# EAGLE design main (EAGLE 7.1.0)
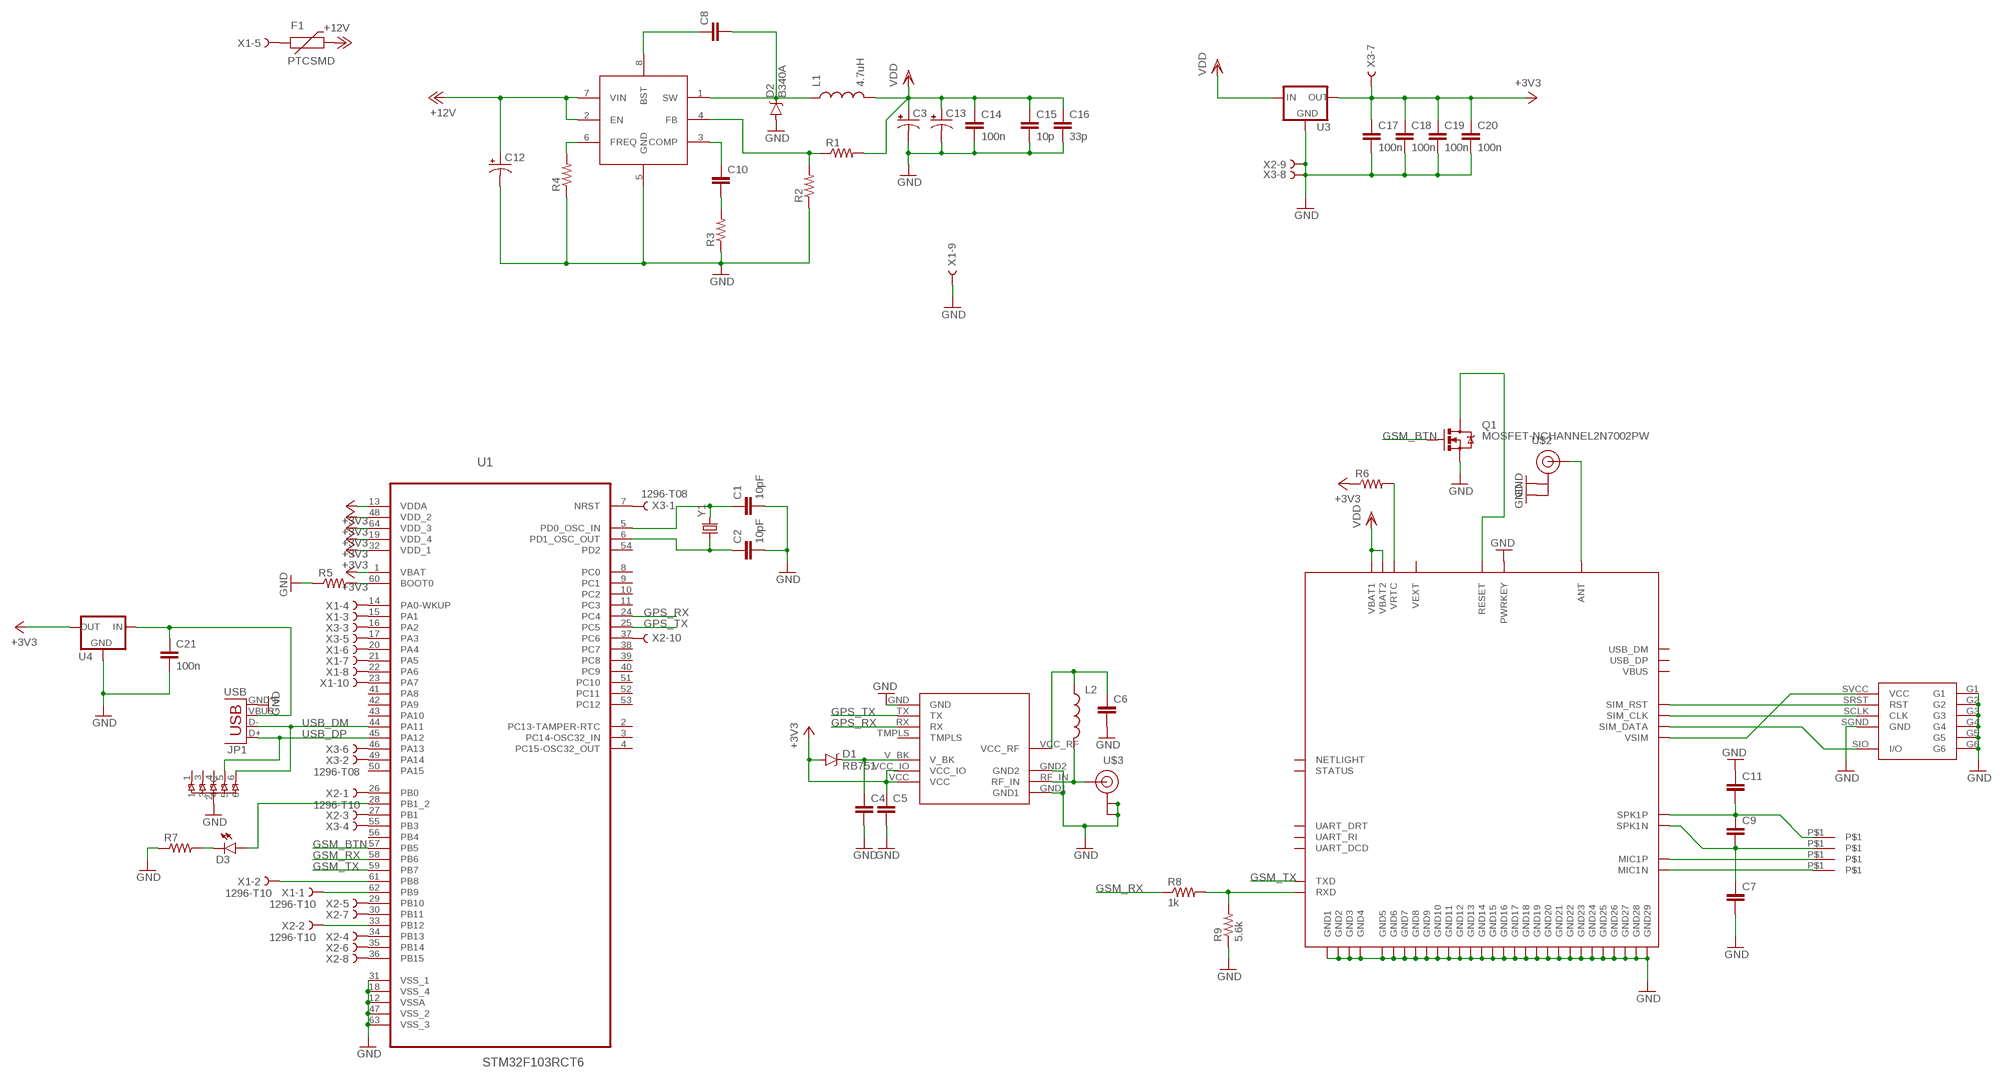
[diagram p0: schematic, sheet 1]

## Parts
C1  10pF  10PF-50V-5%(0603)  [0603-CAP]
C2  10pF  10PF-50V-5%(0603)  [0603-CAP]
C3  CAP_POL6032  [EIA6032]
C4  CAP1210  [1210]
C5  CAP1210  [1210]
C6  CAP0402-CAP  [0402-CAP]
C7  CAP0402-CAP  [0402-CAP]
C8  CAP0805  [0805]
C9  CAP0402-CAP  [0402-CAP]
C10  CAP0402-CAP  [0402-CAP]
C11  CAP0402-CAP  [0402-CAP]
C12  CPOL-USSMCC  [SMC_C]
C13  CAP_POL6032  [EIA6032]
C14  100n  CAP0805  [0805]
C15  10p  CAP0402-CAP  [0402-CAP]
C16  33p  CAP0402-CAP  [0402-CAP]
C17  100n  CAP0805  [0805]
C18  100n  CAP0805  [0805]
C19  100n  CAP0805  [0805]
C20  100n  CAP0805  [0805]
C21  100n  CAP0805  [0805]
D1  RB751  DIODE-SCHOTTKY-RB751  [SOD-523]
D2  B340A  DIODE-SCHOTTKY-B340A  [SMA-DIODE]
D3  LED0603  [LED-0603]
F1  PTCSMD  [PTC-1206]
JP1  USB  [USB-MICROB-2]
L1  4.7uH  INDUCTOR68UH-1A  [CR75]
L2  INDUCTOR0402  [C0402]
Q1  MOSFET-NCHANNEL2N7002PW  [SOT323]
R1  RESISTOR0402-RES  [0402-RES]
R2  RESISTOR0402-RES  [0402-RES]
R3  RESISTOR0402-RES  [0402-RES]
R4  RESISTOR0402-RES  [0402-RES]
R5  RESISTOR0402-RES  [0402-RES]
R6  RESISTOR0402-RES  [0402-RES]
R7  RESISTOR0402-RES  [0402-RES]
R8  1k  RESISTOR0402-RES  [0402-RES]
R9  5.6k  RESISTOR0402-RES  [0402-RES]
U1  STM32F103RCT6  [QFP50P1200X1200X160-64N]
U2  MP1584  [SO8]
U3  XC63FPM  [SOT23]
U4  XC63FPM  [SOT23]
U5  SMF05C  [SC70-6L]
U$1  SIM800_MIN  [SIM800_MIN]
U$2  U.FL  [U.FL2]
U$3  U.FL  [U.FL2]
U$4  VK_GPS_U7_MIN  [VK_GPS_U7_MIN]
U$7  SIM_NOVPP  [WURTH_NANO_SIM_NOVPP]
U$8  PAD1  [PAD1]
U$9  PAD1  [PAD1]
U$13  PAD1  [PAD1]
U$14  PAD1  [PAD1]
X1  1296-T10  [1296-10]
X2  1296-T10  [1296-10]
X3  1296-T08  [1296-08]
Y1  CRYSTAL5X3  [CRYSTAL-SMD-5X3]

## Nets
+3V3: C5.1 C17.1 C18.1 C19.1 C20.1 D1.A R6.1 U1.1(VBAT) U1.13(VDDA) U1.19(VDD_4) U1.32(VDD_1) U1.48(VDD_2) U1.64(VDD_3) U3.2(OUT) U4.2(OUT) U$4.VCC U$4.VCC_IO X3.7
+12V: C12.+ F1.2 U2.2(EN) U2.7(VIN)
GND: C1.2 C2.2 C3.P$2(-) C4.2 C5.2 C6.2 C7.2 C11.1 C12.- C13.P$2(-) C14.2 C15.2 C16.2 C17.2 C18.2 C19.2 C20.2 C21.2 D2.A JP1.GND JP1.MT1(GND) JP1.MT2(GND) JP1.P$1(GND) JP1.P$2(GND) Q1.2(S) R2.1 R3.1 R4.1 R5.1 R7.1 R9.1 U1.12(VSSA) U1.18(VSS_4) U1.31(VSS_1) U1.47(VSS_2) U1.63(VSS_3) U2.5(GND) U3.1(GND) U4.1(GND) U5.2(C) U$1.P$2(GND1) U$1.P$6(GND2) U$1.P$8(GND3) U$1.P$35(GND29) U$1.P$37(GND28) U$1.P$38(GND27) U$1.P$39(GND26) U$1.P$41(GND25) U$1.P$43(GND22) U$1.P$44(GND23) U$1.P$45(GND24) U$1.P$48(PWRKEY) U$1.P$58(GND4) U$1.P$67(GND17) U$1.P$71(GND18) U$1.P$72(GND19) U$1.P$73(GND20) U$1.P$76(GND21) U$1.P$77(GND5) U$1.P$78(GND6) U$1.P$79(GND7) U$1.P$80(GND8) U$1.P$81(GND9) U$1.P$82(GND10) U$1.P$83(GND11) U$1.P$84(GND12) U$1.P$85(GND13) U$1.P$86(GND14) U$1.P$87(GND15) U$1.P$88(GND16) U$2.P$1(GND) U$2.P$2(GND) U$3.P$1(GND) U$3.P$2(GND) U$4.GND U$4.GND1 U$4.GND2 U$7.G1 U$7.G2 U$7.G3 U$7.G4 U$7.G5 U$7.G6 U$7.SGND(GND) X1.9 X2.9 X3.8
GPS_RX: U1.24(PC4) U$4.RX
GPS_TX: U1.25(PC5) U$4.TX
GSM_BTN: Q1.1(G) U1.57(PB5)
GSM_RX: R8.1 U1.58(PB6)
GSM_TX: U1.59(PB7) U$1.P$32(TXD)
N$1: U$1.P$40(ANT) U$2.P$3(SIGNAL)
N$2: C1.1 U1.5(PD0_OSC_IN) Y1.3
N$3: C2.1 U1.6(PD1_OSC_OUT) Y1.1
N$4: U1.16(PA2) X3.3
N$5: U1.17(PA3) X3.5
N$6: U1.7(NRST) X3.1
N$7: U1.55(PB3) X3.4
N$8: U1.49(PA14) X3.2
N$9: U1.46(PA13) X3.6
N$10: C7.1 C9.2 U$1.P$13(SPK1N) U$9.P$1
N$11: U$1.P$15(SIM_RST) U$7.SRST(RST)
N$12: U$1.P$55(SIM_CLK) U$7.SCLK(CLK)
N$13: U$1.P$14(SIM_DATA) U$7.SIO(I/O)
N$14: U$1.P$16(VSIM) U$7.SVCC(VCC)
N$15: C9.1 C11.2 U$1.P$53(SPK1P) U$8.P$1
N$16: U$1.P$52(MIC1P) U$13.P$1
N$17: U$1.P$12(MIC1N) U$14.P$1
N$18: L2.2 U$3.P$3(SIGNAL) U$4.RF_IN
N$19: Q1.3(D) U$1.P$49(RESET)
N$20: U1.61(PB8) X1.2
N$21: C4.1 D1.C U$4.V_BK
N$22: C6.1 L2.1 U$4.VCC_RF
N$23: U1.62(PB9) X1.1
N$24: C8.1 U2.8(BST)
N$25: C8.2 D2.C L1.P$1 U2.1(SW)
N$26: R5.2 U1.60(BOOT0)
N$27: C10.1 U2.3(COMP)
N$28: C10.2 R3.2
N$29: R1.1 R2.2 U2.4(FB)
N$30: U1.15(PA1) X1.3
N$31: U1.14(PA0-WKUP) X1.4
N$32: U1.27(PB1) X2.3
N$33: U1.20(PA4) X1.6
N$34: U1.21(PA5) X1.7
N$35: R4.2 U2.6(FREQ)
N$36: U1.22(PA6) X1.8
N$37: U1.23(PA7) X1.10
N$38: U1.26(PB0) X2.1
N$39: U1.29(PB10) X2.5
N$40: U1.30(PB11) X2.7
N$41: U1.33(PB12) X2.2
N$42: U1.34(PB13) X2.4
N$43: U1.35(PB14) X2.6
N$44: U1.36(PB15) X2.8
N$45: U1.37(PC6) X2.10
N$46: F1.1 X1.5
N$47: C21.1 JP1.VBUS U4.3(IN)
N$49: R6.2 U$1.P$56(VRTC)
N$51: D3.A U1.28(PB1_2)
N$52: D3.C R7.2
N$53: R8.2 R9.2 U$1.P$31(RXD)
USB_DM: JP1.D- U1.44(PA11) U5.6
USB_DP: JP1.D+ U1.45(PA12) U5.5
VDD: C3.P$1(+) C13.P$1(+) C14.1 C15.1 C16.1 L1.P$2 R1.2 U3.3(IN) U$1.P$1(VBAT1) U$1.P$42(VBAT2)
Unconnected: U1.2(PC13-TAMPER-RTC) U1.3(PC14-OSC32_IN) U1.4(PC15-OSC32_OUT) U1.8(PC0) U1.9(PC1) U1.10(PC2) U1.11(PC3) U1.38(PC7) U1.39(PC8) U1.40(PC9) U1.41(PA8) U1.42(PA9) U1.43(PA10) U1.50(PA15) U1.51(PC10) U1.52(PC11) U1.53(PC12) U1.54(PD2) U1.56(PB4) U5.1 U5.3 U5.4 U$1.P$4(STATUS) U$1.P$7(VBUS) U$1.P$18(VEXT) U$1.P$19(USB_DM) U$1.P$59(USB_DP) U$1.P$64(NETLIGHT) U$1.P$68(UART_RI) U$1.P$69(UART_DRT) U$1.P$70(UART_DCD) U$4.TMPLS

## Library data of the parts
C1 C2 = SparkFun-Capacitors:10PF-50V-5%(0603): CAP-11812; PROD_ID: CAP-11812
C3 C13 = SparkFun-Passives:CAP_POL: Capacitor Polarized These are standard SMD and PTH capacitors. Normally 10uF, 47uF, and 100uF in electrolytic and tantalum varieties. Always verify the external diameter of the through hole cap, it varies with capacity, voltage, and manufacturer. The EIA devices should be standard.
C4 C5 = SparkFun-Capacitors:CAP: Capacitor Standard 0603 ceramic capacitor, and 0.1" leaded capacitor.
C6-C11 C14-C21 = SparkFun-Passives:CAP: Capacitor Standard 0603 ceramic capacitor, and 0.1" leaded capacitor.
C12 = rcl:CPOL-US: POLARIZED CAPACITOR, American symbol
D1 = SparkFun-DiscreteSemi:DIODE-SCHOTTKY: Schottky diodes in SFE's production catalog BAT20J 1A 23V 0.62Vf RB751 120mA 40V 0.37Vf PMEG4005EJ 0.5A 40V 0.42Vf MBRA140 1A 40V 0.5Vf B340A 3A 40V SMA; PROD_ID: DIO-11018
D2 = SparkFun-DiscreteSemi:DIODE-SCHOTTKY: Schottky diodes in SFE's production catalog BAT20J 1A 23V 0.62Vf RB751 120mA 40V 0.37Vf PMEG4005EJ 0.5A 40V 0.42Vf MBRA140 1A 40V 0.5Vf B340A 3A 40V SMA; PROD_ID: DIO-09886
D3 = SparkFun-LED:LED: LEDs Standard schematic elements and footprints for 5mm, 3mm, 1206, and 0603 sized LEDs. 5mm - Spark Fun Electronics SKU : COM-00529 (and others)
F1 = SparkFun-PowerIC:PTC: Resettable Fuse PTC Resettable Fuse. Spark Fun Electronics SKU : COM-08357; PROD_ID: RES-11150
JP1 = SparkFun-Connectors:USB: USB Connectors USB-B-PTH is fully proven SKU : PRT-00139/CONN-08278 USB-miniB is fully proven SKU : PRT-00587 USB-A-PCB is untested. USB-A-H is throughly reviewed, but untested. Spark Fun Electronics SKU : PRT-00437 USB-B-SMT is throughly reviewed, but untested. Needs silkscreen touching up. USB-A-S has not been used/tested USB-MB-H has not been used/tested USB-MICROB has been used. CONN-09505
L1 = SparkFun-Passives:INDUCTOR: Inductors Basic Inductor/Choke - 0603 and 1206. Footprints are not proven and vary greatly between part numbers. SRN6045- 33uH, 20% 1.4A SDR0403-560KL - 56uH, 10%, 500mA RMS/740mA peak; PROD_ID: NDUC-09739; VALUE: 68uH
L2 = SparkFun-Passives:INDUCTOR: Inductors Basic Inductor/Choke - 0603 and 1206. Footprints are not proven and vary greatly between part numbers. SRN6045- 33uH, 20% 1.4A SDR0403-560KL - 56uH, 10%, 500mA RMS/740mA peak
Q1 = SparkFun-DiscreteSemi:MOSFET-NCHANNEL: Common NMOSFET Parts MFG P/N Store ID Prod ID FDD8780 TRANS-09984 SI7820DN TRANS-11055 FDS6630A IC-08089 2N7002PW TRANS-11151 FQP30N06L COM-10213 TRANS-10060 BSS123LT1G TRANS-08345 BSS138 TRANS-00830 BS170 2N7000; PROD_ID: TRANS-11151
R1-R9 = SparkFun-Passives:RESISTOR: Resistor Basic schematic elements and footprints for 0603, 1206, and PTH resistors.
U1 = ST Microelctronics_By_element14_Batch_1:STM32F103RCT6: ARM-based 32-bit MCU; MPN: STM32F103RCT6; OC_FARNELL: 1624136; OC_NEWARK: 01P4099; PACKAGE: QFP-64; SUPPLIER: STMICROELECTRONICS
U2 = DueCan:MP1584
U3 U4 = v-reg:XC63FP: Positiv Voltage Regulators www.torex.co.jp/english/product/pro02/pdf/0201_xc62fp.pdf
U5 = DueCan:SMF05C
U$1 = SIM800:SIM800_MIN
U$2 U$3 = SparkFun-Connectors:U.FL: SMD antenna connector- WRL-09144
U$4 = DueCan:VK_GPS_U7_MIN
U$7 = DueCan:SIM_NOVPP
U$8 U$9 U$13 U$14 = DueCan:PAD1
X1 X2 = con-leotronics:1296-T10: 1.27mm SINGLE ROW FEMALE SOCKET Source: http://www.leotronics.co.uk/Conexcon/Data%20Sheets/sec.%20A/1296ing.pdf; OC_FARNELL: unknown; OC_NEWARK: unknown
X3 = con-leotronics:1296-T08: 1.27mm SINGLE ROW FEMALE SOCKET Source: http://www.leotronics.co.uk/Conexcon/Data%20Sheets/sec.%20A/1296ing.pdf; OC_FARNELL: unknown; OC_NEWARK: unknown
Y1 = SparkFun-FreqCtrl:CRYSTAL: Various standard crystals. Proven footprints.; PROD_ID: XTAL-08218

## Board
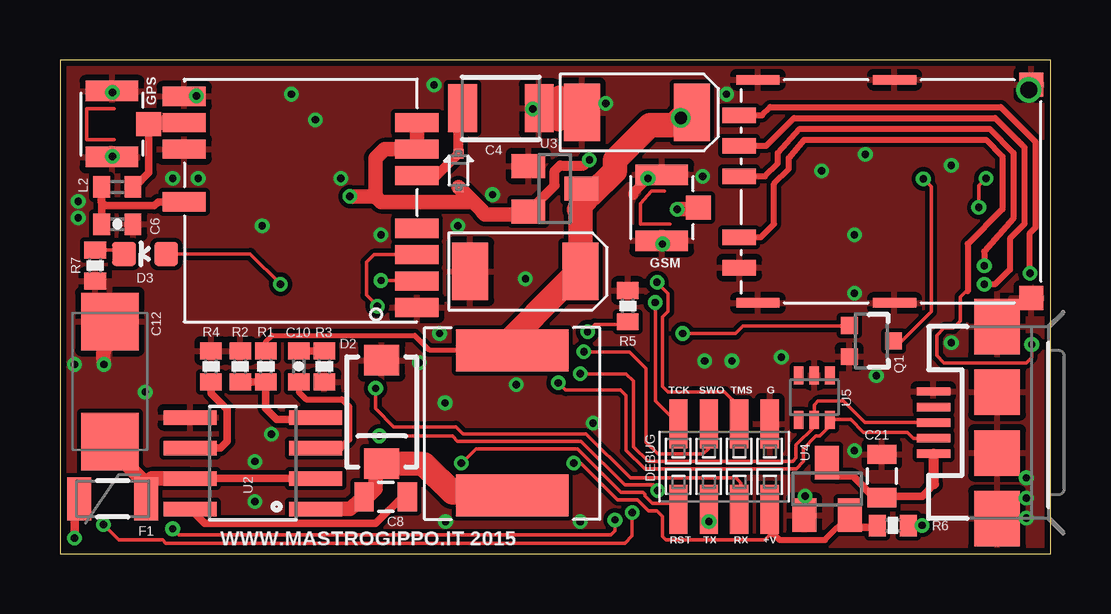
[diagram p1: board, top side]
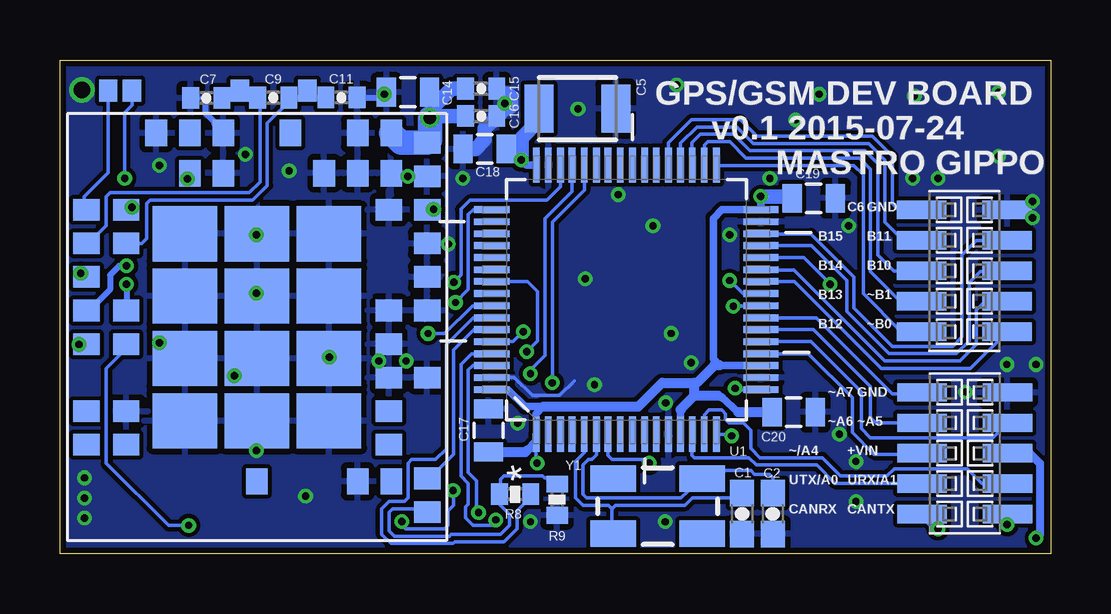
[diagram p2: board, bottom side, seen from below]

Size 41.3 x 20.6 mm. Coordinates in mm from the lower left corner, seen from the top.
Outline: 0,0 41.3,0 41.3,20.6 0,20.6 0,0
Copper layers (1*16): Top 0.035mm / dielectric 1.5mm / Bottom 0.035mm
Design rules "ITEADstudio_DRC": minimum track width 6mil, minimum drill 12mil, track to track 6mil, track to pad 6mil, pad to pad 6mil, via to via 6mil, smd to smd 0mil, copper to edge 10mil, drill to drill 10mil, minimum pad ring 10mil, minimum via ring 6mil, stop-mask expansion 2mil, vias tented up to drill 100mil, thermal gap 10mil

### Footprints (pad centres in the part's own frame; a part is rotated, then mirrored left to right if it is on the bottom)
0603-CAP = smd 1.1 x 1: 1 -0.85,0; 2 0.85,0
EIA6032 = smd 1.5 x 2.4: P$1 -2.3,0; P$2 2.3,0
1210 = smd 1.2 x 2: 1 -1.6,0; 2 1.6,0
0402-CAP = smd 0.7 x 0.9: 1 -0.65,0; 2 0.65,0
0805 = smd 0.8 x 1.2: 1 -0.9,0; 2 0.9,0
SMC_C = smd 2.4 x 2.4: + -2.5,0; - 2.5,0
SOD-523 = smd 0.4 x 0.4: A -0.7,0; C 0.7,0
SMA-DIODE = smd 1.27 x 1.47: A -2.15,0; C 2.15,0
LED-0603 = smd 1 x 1: A 0,-0.877; C 0,0.877
PTC-1206 = smd 1 x 1.8: 1 -1.4,0; 2 1.4,0
USB-MICROB-2 = smd 0.35 x 1.4: D+ 0,2.75; D- -0.65,2.75; GND 1.3,2.75; ID 0.65,2.75; VBUS -1.3,2.75 | smd 2.3 x 1.9: MT1 -4,0.1; MT2 4,0.1 | smd 1.9 x 1.9: P$1 -1.27,0.1; P$2 1.27,0.1
CR75 = smd 1.75 x 4.7: P$1 0,0; P$2 6.05,0
C0402 = smd 0.7 x 0.9: 1 -0.65,0; 2 0.65,0
SOT323 = smd 0.7 x 0.7: 1 -0.65,-0.925; 2 0.65,-0.925; 3 0,0.925
0402-RES = smd 0.7 x 0.9: 1 -0.65,0; 2 0.65,0
QFP50P1200X1200X160-64N = smd 1.473 x 0.279: 1 -5.613,3.759; 2 -5.613,3.251; 3 -5.613,2.743; 4 -5.613,2.261; 5 -5.613,1.753; 6 -5.613,1.245; 7 -5.613,0.762; 8 -5.613,0.254; 9 -5.613,-0.254; 10 -5.613,-0.762; 11 -5.613,-1.245; 12 -5.613,-1.753; 13 -5.613,-2.261; 14 -5.613,-2.743; 15 -5.613,-3.251; 16 -5.613,-3.759; 33 5.613,-3.759; 34 5.613,-3.251; 35 5.613,-2.743; 36 5.613,-2.261; 37 5.613,-1.753; 38 5.613,-1.245; 39 5.613,-0.762; 40 5.613,-0.254; 41 5.613,0.254; 42 5.613,0.762; 43 5.613,1.245; 44 5.613,1.753; 45 5.613,2.261; 46 5.613,2.743; 47 5.613,3.251; 48 5.613,3.759 | smd 0.279 x 1.473: 17 -3.759,-5.613; 18 -3.251,-5.613; 19 -2.743,-5.613; 20 -2.261,-5.613; 21 -1.753,-5.613; 22 -1.245,-5.613; 23 -0.762,-5.613; 24 -0.254,-5.613; 25 0.254,-5.613; 26 0.762,-5.613; 27 1.245,-5.613; 28 1.753,-5.613; 29 2.261,-5.613; 30 2.743,-5.613; 31 3.251,-5.613; 32 3.759,-5.613; 49 3.759,5.613; 50 3.251,5.613; 51 2.743,5.613; 52 2.261,5.613; 53 1.753,5.613; 54 1.245,5.613; 55 0.762,5.613; 56 0.254,5.613; 57 -0.254,5.613; 58 -0.762,5.613; 59 -1.245,5.613; 60 -1.753,5.613; 61 -2.261,5.613; 62 -2.743,5.613; 63 -3.251,5.613; 64 -3.759,5.613
SO8 = smd 0.61 x 2.21: 1 -1.905,-2.616; 2 -0.635,-2.616; 3 0.635,-2.616; 4 1.905,-2.616; 5 1.905,2.616; 6 0.635,2.616; 7 -0.635,2.616; 8 -1.905,2.616
SOT23 = smd 1 x 1.4: 1 -0.95,-1.1; 2 0.95,-1.1; 3 0,1.1
SC70-6L = smd 0.4 x 0.75: 1 -0.65,-0.925; 2 0,-0.925; 3 0.65,-0.925; 4 0.65,0.925; 5 0,0.925; 6 -0.65,0.925
SIM800_MIN = smd 1.1 x 0.9: P$1 0.8,-2.3; P$2 0.8,-3.7; P$4 0.8,-6.5; P$6 0.8,-9.3; P$7 0.8,-10.7; P$8 0.8,-12.1; P$43 2.475,-2.3; P$44 2.475,-3.7; P$45 2.475,-5.1; P$48 2.475,-9.3; P$49 2.475,-10.7; P$64 15.325,-7.9; P$67 15.325,-3.7; P$68 15.325,-2.3 | smd 0.9 x 1.1: P$12 4,-15; P$13 5.4,-15; P$14 6.8,-15; P$15 8.2,-15; P$16 9.6,-15; P$18 12.4,-15; P$19 13.8,-15; P$31 16.6,-0.8; P$32 15.2,-0.8; P$35 11,-0.8; P$37 8.2,-0.8; P$38 6.8,-0.8; P$39 5.4,-0.8; P$40 4,-0.8; P$41 2.6,-0.8; P$42 1.2,-0.8; P$52 4,-13.35; P$53 5.4,-13.35; P$55 8.2,-13.35; P$56 9.6,-13.35; P$58 12.4,-13.35; P$59 13.8,-13.35; P$69 13.8,-2.4; P$70 12.4,-2.4; P$71 11,-2.4; P$72 9.6,-2.4; P$73 8.2,-2.4; P$76 4,-2.4 | smd 2.3 x 2.7: P$77 5,-4.9; P$78 5,-7.9; P$79 5,-10.9; P$80 7.6,-10.9; P$81 10.2,-10.9; P$82 12.8,-10.9; P$83 12.8,-7.9; P$84 12.8,-4.9; P$85 10.2,-4.9; P$86 7.6,-4.9; P$87 7.6,-7.9; P$88 10.2,-7.9
U.FL2 = smd 2.2 x 0.85: P$1 0,1.375; P$2 0,-1.375 | smd 1.05 x 1: P$3 1.525,0
VK_GPS_U7_MIN = smd 1.8 x 0.8: GND -5.08,4.42; GND1 4.62,-4.38; GND2 4.62,-2.18; RF_IN 4.62,-3.28; RX -5.08,2.22; TMPLS -5.08,1.12; TX -5.08,3.32; V_BK -5.08,-1.08; VCC -5.08,-3.28; VCC_IO -5.08,-2.18; VCC_RF 4.62,0.02
WURTH_NANO_SIM_NOVPP = smd 1 x 1: G1 0.2,0.4; G6 9.1,0.4 | smd 0.4 x 1.8: G2 0,6.1; G3 0,11.8; G4 9.3,11.8; G5 9.3,6.1 | smd 0.65 x 1.4: SCLK 6.55,12.57; SGND 1.47,12.57; SIO 7.82,12.57; SRST 5.28,12.57; SVCC 2.74,12.57
PAD1 = smd 0.914 x 0.762: P$1 0,0
1296-10 = smd 0.76 x 2.05: 1 -2.54,-1.78; 2 -2.54,1.78; 3 -1.27,-1.78; 4 -1.27,1.78; 5 0,-1.78; 6 0,1.78; 7 1.27,-1.78; 8 1.27,1.78; 9 2.54,-1.78; 10 2.54,1.78
1296-08 = smd 0.76 x 2.05: 1 -1.905,-1.78; 2 -1.905,1.78; 3 -0.635,-1.78; 4 -0.635,1.78; 5 0.635,-1.78; 6 0.635,1.78; 7 1.905,-1.78; 8 1.905,1.78
CRYSTAL-SMD-5X3 = smd 1.9 x 1.1: 1 -1.85,-1.15; 2 1.85,-1.15; 3 1.85,1.15; 4 -1.85,1.15

### Placement (x,y rotation side)
C1  12.87,1.68 270 bottom
C2  11.59,1.68 270 bottom
C3  19.4,11.78 180 top
C4  18.38,18.58 0 top
C5  19.73,18.58 0 bottom
C6  2.4,13.75 0 top
C7  35.2,19.02 180 bottom
C8  13.58,2.38 180 top
C9  32.41,19.03 180 bottom
C10  9.95,7.82 90 top
C11  29.57,19.04 180 bottom
C12  2.08,7.19 90 top
C13  24.05,18.41 180 top
C14  26.79,19.25 180 bottom
C15  23.75,19.4 0 bottom
C16  23.75,18.26 0 bottom
C17  23.44,5.15 90 bottom
C18  23.59,16.89 180 bottom
C19  9.88,14.83 0 bottom
C20  10.72,5.92 0 bottom
C21  34.26,3.25 90 top
D1  16.61,15.99 90 top
D2  13.41,5.92 270 top
D3  3.55,12.51 90 top
F1  2.2,2.3 0 top
JP1  39.16,5.48 90 top
L1  18.86,2.44 90 top
L2  2.4,15.3 0 top
Q1  33.83,8.88 270 top
R1  8.58,7.82 90 top
R2  7.52,7.82 270 top
R3  11.02,7.82 90 top
R4  6.3,7.82 270 top
R5  23.67,10.33 270 top
R6  34.72,1.19 0 top
R7  1.47,12.03 90 top
R8  22.33,2.49 180 bottom
R9  20.57,2.26 90 bottom
U1  17.69,10.6 90 bottom
U2  8.04,3.78 90 top
U3  20.62,15.23 270 top
U4  31.98,2.71 0 top
U5  31.44,6.52 180 top
U$1  25.19,18.35 270 bottom
U$2  25.09,14.44 0 top
U$3  2.17,17.93 0 top
U$4  9.8,14.7 180 top
U$7  40.89,10.47 90 top
U$8  30.98,19.33 90 bottom
U$9  33.8,19.33 270 bottom
U$13  38.3,19.33 90 bottom
U$14  39.29,19.33 90 bottom
X1  3.58,4.2 90 bottom
X2  3.6,11.81 90 bottom
X3  27.68,3.65 0 top
Y1  16.38,1.99 180 bottom

### Tracks (layer width: path | path; a pad name or v marks a point on that pad's centre or on a via)
+3V3  (via drill 0.3)
  Top 0.152: X3.7 29.66,0.86 29.38,0.58 25.27,0.58 25.12,0.73 25.12,1.57 24.89,1.8 24.54,1.8 24.08,2.26 23.24,2.26 21.72,3.79 v21.41,3.79
  Top 0.254: 29.72,0.86 29.99,0.58 31.89,0.58 U4.2
  Top 0.305: 29.66,0.86 29.72,0.86 | U4.2 32.93,1.54 33.35,1.11 33.99,1.11 R6.1
  Top 0.406: U3.2 19.54,14.28 20.62,15.36 20.62,15.97 20.85,16.2 21.84,16.2 v22.07,16.43
  Top 0.61: 17.17,14.73 17.61,14.29 17.61,14.26 17.73,14.14 19.39,14.14 U3.2 | 17.17,14.73 D1.A | U$4.VCC U$4.VCC_IO 13.53,16.88 13.15,16.51 13.15,14.98 13.08,14.91 | v12.09,14.91 13.08,14.91 | 13.08,14.91 13.15,14.91 13.38,14.68 17.12,14.68 17.17,14.73
  Bottom 0.152: 21.45,5.85 U1.1 | 21.84,4.32 21.48,4.32 v21.41,3.79
  Bottom 0.305: U1.48 21.86,16.22 v22.07,16.43 | U1.19 13.8,7.86 14.07,8.13 14.07,13.99 13.7,14.36 U1.32 v12.08,14.9 v12.09,14.91 | 21.45,5.85 21.15,6.14 21.92,6.14 22.62,6.84 U1.64 | U1.1 21.45,4.7 21.84,4.32 | U1.13 15.43,6 | 13.72,6.53 13.03,5.92
  Bottom 0.356: 13.87,6.61 13.72,6.53
  Bottom 0.406: C17.1 21.9,4.25 21.84,4.32 | C18.1 22.37,17.04 | 13.8,7.86 14.03,7.86 14.75,7.13 14.86,7.13 | 11.63,6.14 C20.1 13.03,5.92 | 21.15,6.14 17.19,6.14 16.2,7.13 14.86,7.13 | 15.43,6 15.43,6.03 14.86,6.61 | 14.86,6.61 14.86,7.13 | 14.86,6.61 13.87,6.61
  Bottom 0.61: v12.08,14.9 10.84,14.9 C19.1 | v22.07,16.43 22.07,17.04 | 22.07,17.04 22.07,17.35 21.38,18.03 21.38,18.52 C5.1 | 22.37,17.04 22.07,17.04
+12V
  Top 0.305: U2.2 U2.7
  Top 0.61: U2.7 3.83,3.15 3.6,2.92 | 3.6,2.92 F1.2 | C12.+ 2.08,4.44 3.6,2.92
GND  (via drill 0.3, 0.7)
  Top 0.152: 20.77,18.03 20.53,18.03 C4.2 | JP1.MT2 38.59,9.48
  Top 0.406: 23.9,14.98 23.9,15.06 v24.51,15.67
  Top 0.61: v1.83,7.9 1.8,8.34 C12.-
  Top 0.813: 20.81,19.14 20.77,18.03
  Bottom 0.152: C7.2 35.32,19.02 35.25,18.95 | v37.16,8.81 36.75,8.81 U$1.P$81 | U1.63 22.36,7.35 21.61,6.6 20.47,6.6 19.86,7.21
  Bottom 0.254: 35.25,18.95 35.25,18.41 34.87,18.03 34.87,17.93 U$1.P$6 | C11.1 27.92,19.04 v27.78,19.17
  Bottom 0.61: 22.6,18.72 23.1,18.22 | C18.2 23.97,16.89 23.59,17.27 23.59,17.73 23.1,18.22 | C16.2 23.1,18.22
  Bottom 0.813: 22.6,18.72 22.6,19.02 22.68,19.1
  other vias: 30.07,8.2 22.22,5.46 33.12,13.31 37.16,16.2 31.75,15.97 19.4,11.48 16.05,6.3 19.02,7.06 8.81,5 8.12,3.86 4.7,15.67 5.76,15.67 19.71,18.56 2.18,16.58 5.69,19.1 8.12,2.18 16.07,1.34 15.59,19.55 26.87,8.05 2.18,19.25 33.58,16.66 31.06,2.41 16.58,13.69 40.28,3.17 40.28,2.33 40.28,1.5 33.12,10.87 25.12,12.93 26.79,15.74 22.76,18.79 18.03,14.98 11.71,15.67 3.55,6.75 13.38,13.31 33.12,4.31 0.76,14.7 0.76,14.02 28.01,8.05 34.03,7.44 40.38,19.35 0.61,7.9 21.69,1.34 10.64,18.11 9.65,19.17 14.98,7.97 15.82,9.19 8.43,13.69
  pour Bottom (isolate 0.178): 0,0 41.3,0 41.3,20.56 0,20.56
  pour Top (isolate 0.178): 0,0 41.3,0 41.3,20.56 0,20.56
GPS_RX  (via drill 0.3)
  Top 0.152: U$4.RX 13.09,12.48 12.77,12.16 12.77,10.79 v13.23,10.33
  Bottom 0.152: v13.23,10.33 12.09,10.33 U1.24
GPS_TX  (via drill 0.3)
  Top 0.152: v13.38,11.4 14.85,11.4 U$4.TX
  Bottom 0.152: U1.25 12.84,10.86 v13.38,11.4
GSM_BTN  (via drill 0.3)
  Top 0.152: v25.96,9.19 28.17,9.19 28.47,9.5 32.86,9.5 Q1.1
  Bottom 0.152: U1.57 24.11,10.35 25.27,9.19 v25.96,9.19
GSM_RX
  Bottom 0.152: U1.58 24.09,9.84 25.19,8.73 25.19,4.39 25.65,3.93 26.64,3.93 26.79,3.78 26.79,2.33 26.94,2.19 27.58,2.19 27.89,1.88 27.89,0.81 27.51,0.43 24.92,0.43 24.84,0.51 22.78,0.51 22.25,1.04 22.25,1.81 21.68,2.38 R8.1
GSM_TX
  Bottom 0.152: U1.59 24.04,9.36 24.89,8.51 24.89,4.16 25.5,3.55 25.59,3.55 U$1.P$32
N$1  (via drill 0.3)
  Top 0.61: v25.73,14.37 26.83,14.37 U$2.P$3
  Bottom 0.305: U$1.P$40 25.67,14.35 v25.73,14.37
N$2
  Bottom 0.152: U1.5 19.44,4.23 19.81,3.86 19.81,2.34 19.51,2.03 18.44,2.03 18.29,1.88 | 18.29,1.88 18.29,0.86 Y1.3 | 13.14,2.53 C1.1 13.06,2.34 14.93,2.34 15.24,2.03 18.14,2.03 18.29,1.88
N$3
  Bottom 0.152: U1.6 18.94,4.13 19.13,3.94 19.28,3.94 19.51,3.71 19.51,2.49 19.35,2.34 15.41,2.34 Y1.1 13.9,3.14 13.56,3.48 12.5,3.48 12.34,3.33 11.73,3.33 11.58,3.18 C2.1
N$4  (via drill 0.3)
  Top 0.152: v13.31,4.92 16.35,4.92 16.58,4.7 21.72,4.7 23.55,2.87 24.73,2.87 v24.92,2.64 | v27.05,1.35 27.1,1.77 X3.3
  Bottom 0.152: U1.16 13.47,4.99 v13.31,4.92 | v24.92,2.64 24.89,2.03 25.12,1.8 25.12,1.19 25.26,1.04 26.9,1.04 27.05,1.2 v27.05,1.35
N$5  (via drill 0.3)
  Top 0.152: v13.15,6.91 13.15,6.07 13.92,5.31 16.51,5.31 16.81,5 21.92,5 23.77,3.18 arc-1 28.19,3.18 28.39,2.94 28.39,1.79 X3.5
  Bottom 0.152: U1.17 13.02,6.84 v13.15,6.91
N$6  (via drill 0.3)
  Top 0.152: 25.84,1.8 X3.1 | 25.54,2.11 X3.1 | v16.74,3.78 17.34,4.39 21.57,4.39 23.39,2.57 24.31,2.57 24.38,2.49 24.38,2.41 24.69,2.11 25.53,2.11 X3.1
  Bottom 0.152: U1.7 18.45,4.11 18.29,3.94 16.89,3.94 v16.74,3.78
N$7  (via drill 0.3)
  Top 0.152: v21.84,8.43 23.75,8.43 24.43,7.74 24.43,4.65 24.92,4.17 26.8,4.17 27.02,4.39 27.02,5.02 X3.4
  Bottom 0.152: U1.55 21.81,11.37 21.38,10.94 21.38,8.89 v21.84,8.43
N$8  (via drill 0.3)
  Top 0.152: v24.81,10.49 24.81,6.39 X3.2
  Bottom 0.152: U1.49 24.06,14.36 24.28,14.14 24.28,11.02 v24.81,10.49
N$9  (via drill 0.3)
  Top 0.152: v24.89,11.33 25.35,10.87 25.35,10.11 25.12,9.88 25.12,6.98 25.35,6.75 27.71,6.75 28.32,6.14 X3.6 | X3.6
  Bottom 0.152: U1.46 20.43,15.32 21,14.75 24.2,14.75 24.58,14.37 24.58,11.63 v24.89,11.33
N$10
  Bottom 0.152: U$1.P$13 40.1,12.95 39.37,13.69 39.37,14.91 39.21,15.06 33.42,15.06 32.97,15.52 32.97,18.89 C9.2
  Bottom 0.254: C7.1 33.73,19.02 | 33.73,19.02 C9.2 | U$9.P$1 33.8,19.09 33.73,19.02
N$11  (via drill 0.3)
  Top 0.254: U$7.SRST 29.39,15.75 29.92,16.28 29.92,16.74 30.83,17.73 38.76,17.73 39.75,16.74 39.75,13.99 38.53,12.62 v38.53,12.01
  Bottom 0.152: 40.16,10.11 U$1.P$15
  Bottom 0.254: v38.53,12.01 38.83,12.01 39.21,11.63 39.21,11.02 39.75,10.49 40.16,10.11
N$12  (via drill 0.3)
  Top 0.254: v38.53,11.25 38.99,11.25 39.6,11.86 39.6,13.15 40.2,13.76 40.2,16.96 38.99,18.18 30.6,18.18 29.44,17.02 U$7.SCLK
  Bottom 0.254: v38.53,11.25 U$1.P$55
N$13  (via drill 0.3)
  Top 0.254: U$7.SIO 29.26,18.29 29.61,18.64 39.21,18.64 40.66,17.19 40.66,13.61 40.43,13.38 v40.43,11.71
  Bottom 0.254: U$1.P$14 40.28,11.55 v40.43,11.71
N$14  (via drill 0.3)
  Top 0.152: 37.84,10.94 37.77,10.94 37.54,10.72 37.54,9.73 37.23,9.42 36.85,9.42 36.55,9.12 36.55,8.28 36.85,7.97 40.28,7.97 40.51,8.2 v40.51,8.73
  Top 0.254: U$7.SVCC 29.21,13.21 29.77,13.76 29.77,15.44 30.38,16.05 30.38,16.52 31.03,17.27 38.6,17.27 39.29,16.58 39.29,14.37 37.84,12.93 37.84,10.94
  Bottom 0.254: U$1.P$16 39.96,8.72 v40.51,8.73
N$15
  Bottom 0.152: U$1.P$53 37.89,12.95 37.69,13.15 37.69,14.6 37.54,14.75 33.27,14.75 32.66,15.36 32.66,17.95 31.59,19.03 C9.1
  Bottom 0.254: 31.59,19.03 31.14,19.03 | 31.14,19.03 C11.2 | U$8.P$1 31.06,19.1 31.14,19.03
N$16  (via drill 0.3)
  Top 0.152: v38.3,14.45 38.3,15.36 v38.6,15.67
  Bottom 0.152: U$1.P$52 38.47,14.35 v38.3,14.45 | v38.6,15.67 38.6,18.41 38.3,18.72 U$13.P$1
N$17
  Bottom 0.152: U$14.P$1 39.29,15.9 40.28,14.91 40.28,14.44 U$1.P$12
N$18
  Top 0.305: L2.2 3.11,15.3 3.71,15.9 3.71,17.84 U$3.P$3
  Top 0.61: U$4.RF_IN 3.52,17.98 U$3.P$3
N$19  (via drill 0.3)
  Top 0.152: Q1.3 35.06,8.84 36.32,10.11 36.32,15.32 v35.99,15.65
  Bottom 0.406: v35.99,15.65 35.89,15.65 U$1.P$49
N$20  (via drill 0.3)
  Top 0.152: v4.7,1.05 4.95,0.8 22.97,0.8 23.14,0.96 v23.14,1.42
  Bottom 0.152: U1.61 24.14,8.34 24.58,7.9 24.58,3.25 24.28,2.94 24.28,2.06 24.38,1.96 24.38,1.5 24.08,1.2 23.13,1.2 v23.14,1.42
  Bottom 0.33: v4.7,1.05 4.75,1.05 X1.2
  Bottom 0.406: 5.93,1.66 X1.2 5.31,1.66
N$21
  Top 0.406: U$4.V_BK 15.7,15.78 D1.C 16.61,18.34 C4.1
N$22
  Top 0.305: U$4.VCC_RF 4.09,14.68 3.93,14.53 1.88,14.53 1.72,14.68 1.72,15.28 L2.1 C6.1
N$23  (via drill 0.3)
  Top 0.152: v1.81,1.22 2.46,0.58 4.29,0.58 4.42,0.45 23.54,0.45 23.85,0.76 v23.85,1.73
  Bottom 0.152: U1.62 24.09,7.86 24.28,7.67 24.28,3.4 23.93,3.05 23.93,1.81 v23.85,1.73 | v1.81,1.22 1.86,1.72 X1.1
N$24
  Top 0.305: C8.1 14.29,2.41 13.15,1.27 6.04,1.27 U2.8
N$25
  Top 0.61: U2.1 12.1,1.88 C8.2 12.62,2.18 13.15,2.71 13.15,3.61 D2.C
  Top 1.016: D2.C 15.02,3.77 15.17,3.75 16.35,2.56 18.81,2.56 L1.P$1
N$26  (via drill 0.3)
  Top 0.152: v21.99,9.27 22.3,9.57 23.63,9.57 R5.2
  Bottom 0.152: U1.60 22.41,8.85 v21.99,9.27
N$27
  Top 0.254: C10.1 9.95,6.75 10.26,6.45 11.75,6.45 12.06,6.14 12.06,4.77 11.7,4.42
  Top 0.305: U2.3 11.7,4.42
N$28
  Top 0.305: R3.2 C10.2
N$29
  Top 0.305: R2.2 R1.1 8.58,6.07 9.04,5.61 10.28,5.61 U2.4
N$30
  Bottom 0.152: X1.3 1.81,2.94 2.87,2.94 3.48,3.55 6.52,3.55 6.82,3.25 8.76,3.25 9.52,4.02 12.12,4.02 12.5,4.4 12.5,5.16 12.8,5.46 13.41,5.46 13.56,5.62 13.56,5.84 13.72,6 14.25,6 14.44,5.8 U1.15
N$31
  Bottom 0.152: U1.14 14.95,4.11 14.86,4.02 12.57,4.02 12.27,3.71 9.75,3.71 8.99,2.95 5.38,2.95 X1.4 5.37,2.94
N$32
  Bottom 0.152: U1.27 10.71,11.85 6.91,8.05 3.78,8.05 3.1,8.73 3.1,10.18 2.71,10.56 1.85,10.56 X2.3
N$33
  Bottom 0.152: U1.20 10.1,8.34 8.28,6.52 8.28,5.08 7.36,4.16 5.4,4.16 X1.6
N$34
  Bottom 0.152: U1.21 9.99,8.85 7.9,6.75 7.9,5.23 7.52,4.85 2.42,4.85 X1.7
N$35
  Top 0.305: U2.6 6.7,4.42 6.98,4.7 6.98,6.02 6.3,6.7 R4.2
N$36
  Bottom 0.152: U1.22 9.89,9.36 7.52,6.98 7.52,5.69 7.29,5.46 5.37,5.46 X1.8
N$37
  Bottom 0.152: U1.23 9.77,9.84 6.6,6.68 5.42,6.68 X1.10
N$38
  Bottom 0.152: U1.26 10.68,11.37 7.06,7.74 3.34,7.74 X2.1
N$39
  Bottom 0.152: X2.5 1.84,11.78 2.94,11.78 3.4,11.33 3.4,8.89 3.93,8.35 6.75,8.35 8.51,10.11 8.51,11.4 9.97,12.86 U1.29
N$40
  Bottom 0.152: X2.7 3.1,13.08 3.71,12.47 3.71,9.04 4.09,8.66 6.6,8.66 8.2,10.26 8.2,11.55 9.99,13.35 U1.30
N$41
  Bottom 0.152: X2.2 6.22,9.27 7.82,10.87 7.82,15.82 8.2,16.2 13.92,16.2 U1.33
N$42
  Bottom 0.152: X2.4 6.27,10.54 7.52,11.78 7.52,16.05 7.97,16.51 12.7,16.51 13.38,17.19 14.3,17.19 14.44,17.05 U1.34
N$43
  Bottom 0.152: X2.6 6.55,11.81 7.21,12.47 7.21,16.28 7.74,16.81 12.54,16.81 13.23,17.5 14.6,17.5 14.95,17.15 U1.35
N$44
  Bottom 0.152: X2.8 6.14,13.08 6.91,13.84 6.91,16.43 7.59,17.12 12.39,17.12 13.08,17.8 14.75,17.8 15.43,17.13 U1.36
N$45
  Bottom 0.152: U1.37 15.94,17.15 14.98,18.11 12.93,18.11 12.24,17.42 7.44,17.42 6.6,16.58 6.6,14.6 6.37,14.37 5.41,14.37 X2.10
N$46  (via drill 0.3)
  Top 0.356: v0.61,0.66 0.61,2.11 F1.1
  Bottom 0.33: 0.45,0.81 0.45,3.78 0.87,4.2 X1.5
  Bottom 0.356: 0.45,0.81 v0.61,0.66
N$47
  Top 0.305: 36.44,2.91 35.94,2.41 34.32,2.41 C21.1 33.94,2.35 33.04,3.25 32.39,3.25 U4.3
  Top 0.406: JP1.VBUS 36.41,2.93 36.44,2.91
N$48
  Top 0.152: 2.26,17.27 1.11,17.27 1.11,18.56 2.26,18.56
N$49  (via drill 0.3)
  Top 0.152: v35.94,1.19 R6.2
  Bottom 0.152: U$1.P$56 38.54,8.57 39.37,7.74 39.37,3.78 36.78,1.19 v35.94,1.19
N$50
  Top 0.152: 25.42,13.76 24.2,13.76 24.2,14.6 24.66,15.14 25.19,15.14
N$51  (via drill 0.3)
  Top 0.152: D3.A 7.93,12.51 v9.19,11.25
  Bottom 0.152: U1.28 10.3,12.36 v9.19,11.25
N$52
  Top 0.152: D3.C 2.57,12.67 R7.2
N$53
  Bottom 0.152: U$1.P$31 26.27,1.88 27.43,1.88 27.58,1.73 27.58,0.97 27.36,0.74 25.07,0.74 24.99,0.81 22.94,0.81 22.55,1.2 22.55,1.65 22.98,2.07 R8.2 22.94,2.53 22.94,3.1 22.78,3.25 21.18,3.25 21.11,3.18 21.03,3.18 20.77,2.91 R9.2
USB_DM  (via drill 0.3)
  Top 0.152: v20.77,7.13 21.08,6.83 23.36,6.83 23.59,6.6 23.59,4.32 24.38,3.56 30.71,3.56 30.98,3.86 30.98,4.39 31.52,4.92 31.67,4.92 32.09,5.35 U5.6 32.1,5.61 32.97,5.61 33.5,5.08 35.33,5.08 35.58,4.83 JP1.D-
  Bottom 0.152: U1.44 19.44,15.17 20.77,13.84 v20.77,7.13
USB_DP  (via drill 0.3)
  Top 0.152: v21.69,7.52 23.59,7.52 23.9,7.21 23.9,4.47 24.54,3.86 30.56,3.86 30.68,4.01 30.68,4.54 31.44,5.31 U5.5 31.44,6.22 31.59,6.37 32.66,6.37 33.55,5.48 JP1.D+
  Bottom 0.152: U1.45 19.95,15.12 21.08,13.99 21.08,8.28 21.69,7.67 v21.69,7.52
VDD  (via drill 0.51)
  Top 0.203: R1.2 8.58,8.86 8.84,9.12 14.78,9.12 15.39,8.51 18.33,8.51 18.34,8.51
  Top 0.305: 18.34,8.51 18.79,8.51 L1.P$2 | v25.88,18.18 26.27,18.18 C13.P$1
  Top 0.406: U3.3 21.9,15.23 22.15,14.98
  Top 0.813: 21.53,14.37 21.8,14.64
  Top 1.016: 21.76,11.42 C3.P$1 | C3.P$1 21.7,14.54 21.8,14.64 22.15,14.98 23.14,15.97 23.14,16.43 24.58,17.88 25.57,17.88 v25.88,18.18 | C3.P$1 21.7,12.46 | C3.P$1 21.7,11.42 21.25,11.42 18.34,8.51
  Bottom 0.305: C14.1 25.67,18.72 25.89,18.2 v25.88,18.18
  Bottom 0.61: C15.1 24.98,19.4 25.67,18.72 | C16.1 25.8,18.26 v25.88,18.18
  Bottom 1.016: v25.88,18.18 25.88,17.26 U$1.P$42 27.09,17.15 U$1.P$1

### Text on the board
tNames: GPS | GSM | TCK | SWO | TMS | G | DEBUG | WWW.MASTROGIPPO.IT 2015 | RST | TX | RX | +V
bNames: GPS/GSM DEV BOARD | v0.1 2015-07-24 | MASTRO GIPPO | GND | C6 | B11 | B15 | B10 | B14 | ~B1 | B13 | ~B0 | B12 | GND | ~A7 | ~A5 | ~A6 | +VIN | ~/A4 | URX/A1 | UTX/A0 | CANTX | CANRX